# EAGLE design motoko_4_0 (EAGLE 9.0.0)
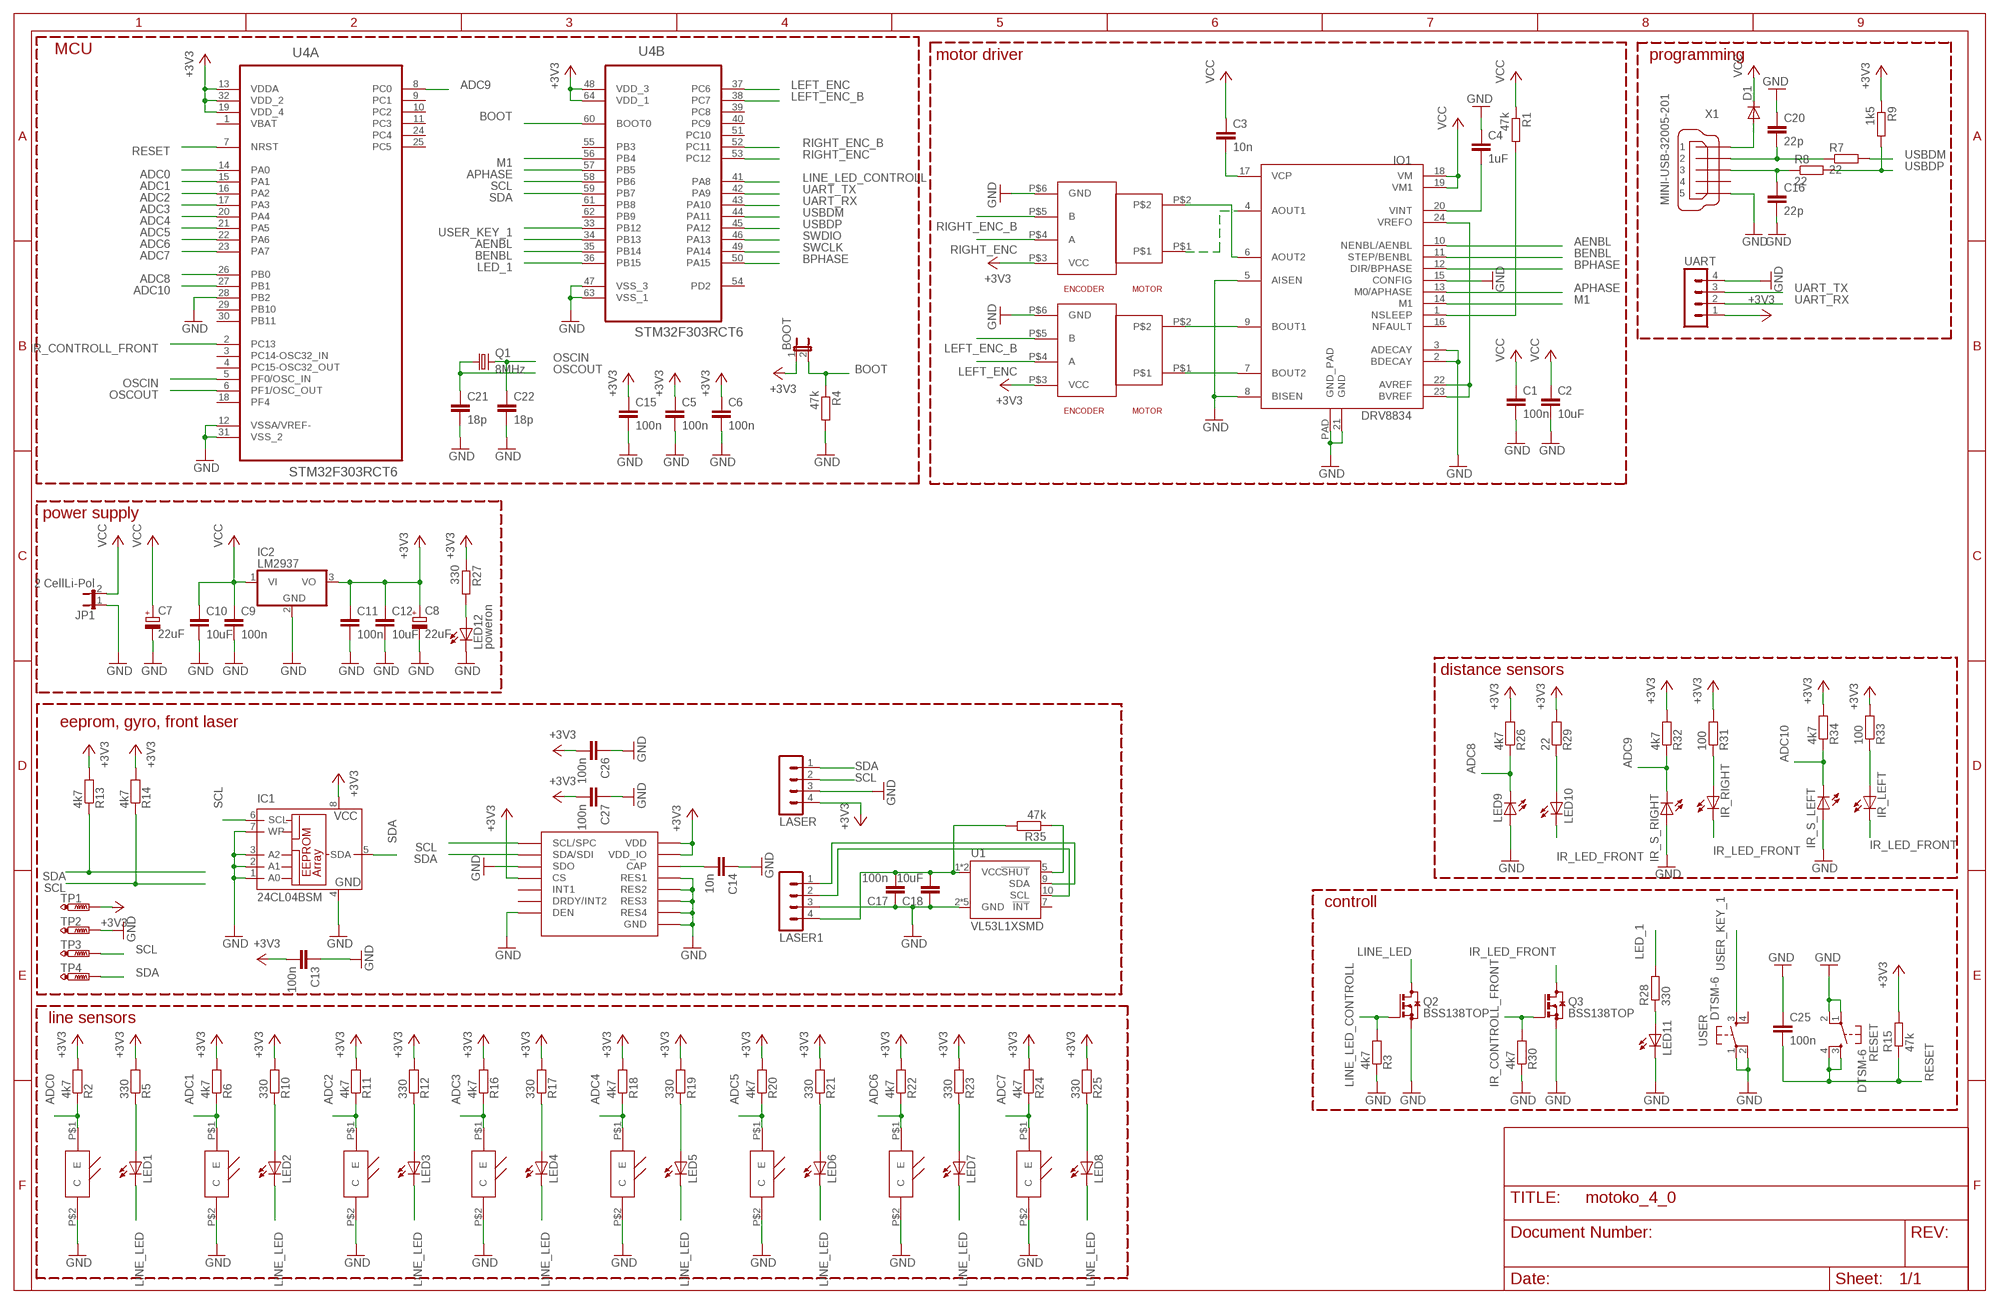
[diagram p0: schematic, sheet 1]

## Parts
BOOT  JP1E  [JP1]
C1  100n  C-EUC1206  [C1206]
C2  10uF  C-EUC1206  [C1206]
C3  10n  C-EUC1206  [C1206]
C4  1uF  C-EUC1206  [C1206]
C5  100n  C-EUC0805  [C0805]
C6  100n  C-EUC0805  [C0805]
C7  22uF  CPOL-EU153CLV-0505  [153CLV-0505]
C8  22uF  CPOL-EU153CLV-0505  [153CLV-0505]
C9  100n  C-EUC0805  [C0805]
C10  10uF  C-EUC0805  [C0805]
C11  100n  C-EUC0805  [C0805]
C12  10uF  C-EUC0805  [C0805]
C13  100n  C-EUC0805  [C0805]
C14  10n  C-EUC0805  [C0805]
C15  100n  C-EUC0805  [C0805]
C16  22p  C-EUC0805  [C0805]
C17  100n  C-EUC0805  [C0805]
C18  10uF  C-EUC0805  [C0805]
C20  22p  C-EUC0805  [C0805]
C21  18p  C-EUC0805  [C0805]
C22  18p  C-EUC0805  [C0805]
C25  100n  C-EUC0805  [C0805]
C26  100n  C-EUC0805  [C0805]
C27  100n  C-EUC0805  [C0805]
D1  DIODE-SMB  [SMB]
IC1  24CL04BSM  [SO-08M]
IC2  LM2937  [TO263-3]
IO1  DRV8834  [DRV8834_PCK]
IR_LEFT  LED5MM  [LED5MM]
IR_RIGHT  LED5MM  [LED5MM]
IR_S_LEFT  LED5MM  [LED5MM]
IR_S_RIGHT  LED5MM  [LED5MM]
JP1  2 CellLi-Pol  JP1E  [JP1]
LASER  MA04-1  [MA04-1]
LASER1  MA04-1  [MA04-1]
LED1  LEDCHIPLED_1206  [CHIPLED_1206]
LED2  LEDCHIPLED_1206  [CHIPLED_1206]
LED3  LEDCHIPLED_1206  [CHIPLED_1206]
LED4  LEDCHIPLED_1206  [CHIPLED_1206]
LED5  LEDCHIPLED_1206  [CHIPLED_1206]
LED6  LEDCHIPLED_1206  [CHIPLED_1206]
LED7  LEDCHIPLED_1206  [CHIPLED_1206]
LED8  LEDCHIPLED_1206  [CHIPLED_1206]
LED9  LED5MM  [LED5MM]
LED10  LED5MM  [LED5MM]
LED11  LEDCHIPLED_1206  [CHIPLED_1206]
LED12  poweron  LEDCHIPLED_1206  [CHIPLED_1206]
LSM6DS0  L3GD20H  [LGA16L]
Q1  8MHz  CRYSTALCTS406  [CTS406]
Q2  BSS138TOP  [SOT23]
Q3  BSS138TOP  [SOT23]
R1  47k  R-EU_M1206  [M1206]
R2  4k7  R-EU_M0805  [M0805]
R3  4k7  R-EU_M0805  [M0805]
R4  47k  R-EU_M0805  [M0805]
R5  330  R-EU_M0805  [M0805]
R6  4k7  R-EU_M0805  [M0805]
R7  22  R-EU_M0805  [M0805]
R8  22  R-EU_M0805  [M0805]
R9  1k5  R-EU_M0805  [M0805]
R10  330  R-EU_M0805  [M0805]
R11  4k7  R-EU_M0805  [M0805]
R12  330  R-EU_M0805  [M0805]
R13  4k7  R-EU_M0805  [M0805]
R14  4k7  R-EU_M0805  [M0805]
R15  47k  R-EU_M0805  [M0805]
R16  4k7  R-EU_M0805  [M0805]
R17  330  R-EU_M0805  [M0805]
R18  4k7  R-EU_M0805  [M0805]
R19  330  R-EU_M0805  [M0805]
R20  4k7  R-EU_M0805  [M0805]
R21  330  R-EU_M0805  [M0805]
R22  4k7  R-EU_M0805  [M0805]
R23  330  R-EU_M0805  [M0805]
R24  4k7  R-EU_M0805  [M0805]
R25  330  R-EU_M0805  [M0805]
R26  4k7  R-EU_M0805  [M0805]
R27  330  R-EU_M0805  [M0805]
R28  330  R-EU_M0805  [M0805]
R29  22  R-EU_M0805  [M0805]
R30  4k7  R-EU_M0805  [M0805]
R31  100  R-EU_M0805  [M0805]
R32  4k7  R-EU_M0805  [M0805]
R33  100  R-EU_M0805  [M0805]
R34  4k7  R-EU_M0805  [M0805]
R35  47k  R-EU_M0805  [M0805]
RESET  DTSM-6  [DTSM-6]
TP1  PTR1B1,27  [B1,27]
TP2  PTR1B1,27  [B1,27]
TP3  PTR1B1,27  [B1,27]
TP4  PTR1B1,27  [B1,27]
U1  VL53L1XSMD  [VL53L1X]
U4  STM32F303RCT6  [QFP50P1200X1200X160-64N]
U$3  SFH3710  [SFH3710]
U$4  SFH3710  [SFH3710]
U$5  SFH3710  [SFH3710]
U$6  SFH3710  [SFH3710]
U$7  SFH3710  [SFH3710]
U$8  SFH3710  [SFH3710]
U$9  SFH3710  [SFH3710]
U$10  SFH3710  [SFH3710]
U$11  POLOLU_GEAR_MOTORPOLO  [POLOLU_GEAR_MOTOR]
U$12  POLOLU_GEAR_MOTORPOLO  [POLOLU_GEAR_MOTOR]
UART  MA04-1  [MA04-1]
USER  DTSM-6  [DTSM-6]
X1  MINI-USB-32005-201  [32005-201]

## Nets
+3V3: BOOT.1 C5.1 C6.1 C8.+ C11.1 C12.1 C13.2 C15.1 C26.2 C27.2 IC1.8(VCC) IC2.3(VO) LASER.4 LSM6DS0.P$1(VDD_IO) LSM6DS0.P$5(CS) LSM6DS0.P$16(VDD) R2.2 R5.2 R6.2 R9.1 R10.2 R11.2 R12.2 R13.2 R14.2 R15.2 R16.2 R17.2 R18.2 R19.2 R20.2 R21.2 R22.2 R23.2 R24.2 R25.2 R26.2 R27.1 R29.2 R31.2 R32.2 R33.2 R34.2 TP1.TP U4.13(A:VDDA) U4.19(A:VDD_4) U4.32(A:VDD_2) U4.48(B:VDD_3) U4.64(B:VDD_1) U$11.P$3(VCC) U$12.P$3(VCC) UART.1
ADC0: R2.1 U4.14(A:PA0) U$3.P$1(E)
ADC1: R6.1 U4.15(A:PA1) U$4.P$1(E)
ADC2: R11.1 U4.16(A:PA2) U$5.P$1(E)
ADC3: R16.1 U4.17(A:PA3) U$6.P$1(E)
ADC4: R18.1 U4.20(A:PA4) U$7.P$1(E)
ADC5: R20.1 U4.21(A:PA5) U$8.P$1(E)
ADC6: R22.1 U4.22(A:PA6) U$9.P$1(E)
ADC7: R24.1 U4.23(A:PA7) U$10.P$1(E)
ADC8: LED9.K(C) R26.1 U4.26(A:PB0)
ADC9: IR_S_RIGHT.K(C) R32.1 U4.8(A:PC0)
ADC10: IR_S_LEFT.K(C) R34.1 U4.27(A:PB1)
AENBL: IO1.10(NENBL/AENBL) U4.34(B:PB13)
APHASE: IO1.13(M0/APHASE) U4.57(B:PB5)
BENBL: IO1.11(STEP/BENBL) U4.35(B:PB14)
BOOT: BOOT.2 R4.1 U4.60(B:BOOT0)
BPHASE: IO1.12(DIR/BPHASE) U4.50(B:PA15)
GND: C1.2 C2.2 C4.1 C5.2 C6.2 C7.- C8.- C9.2 C10.2 C11.2 C12.2 C13.1 C14.1 C15.2 C16.2 C17.1 C18.1 C20.1 C21.2 C22.2 C25.1 C26.1 C27.1 IC1.1(A0) IC1.2(A1) IC1.3(A2) IC1.4(GND) IC1.7(WP) IC2.2(GND) IO1.2(BDECAY) IO1.3(ADECAY) IO1.5(AISEN) IO1.8(BISEN) IO1.15(CONFIG) IO1.21(GND) IO1.PAD(GND_PAD) IR_S_LEFT.A IR_S_RIGHT.A JP1.1 LASER1.3 LASER.3 LED9.A LED11.C LED12.C LSM6DS0.P$4(SDO) LSM6DS0.P$8(DEN) LSM6DS0.P$9(RES1) LSM6DS0.P$10(RES2) LSM6DS0.P$11(RES3) LSM6DS0.P$12(GND) LSM6DS0.P$13(GND) LSM6DS0.P$15(RES4) Q2.2(S) Q3.2(S) R3.1 R4.2 R30.1 RESET.1 RESET.2 TP2.TP U1.2(GND) U1.3(GND) U1.4(GND) U1.6(GND) U1.12(GND) U4.12(A:VSSA/VREF-) U4.28(A:PB2) U4.31(A:VSS_2) U4.47(B:VSS_3) U4.63(B:VSS_1) U$3.P$2(C) U$4.P$2(C) U$5.P$2(C) U$6.P$2(C) U$7.P$2(C) U$8.P$2(C) U$9.P$2(C) U$10.P$2(C) U$11.P$6(GND) U$12.P$6(GND) UART.4 USER.1 USER.2 X1.5
IR_CONTROLL_FRONT: Q3.1(G) R30.2 U4.2(A:PC13)
IR_LED_FRONT: IR_LEFT.K(C) IR_RIGHT.K(C) LED10.K(C) Q3.3(D)
LED_1: R28.2 U4.36(B:PB15)
LEFT_ENC: U4.37(B:PC6) U$11.P$4(A)
LEFT_ENC_B: U4.38(B:PC7) U$11.P$5(B)
LINE_LED: LED1.C LED2.C LED3.C LED4.C LED5.C LED6.C LED7.C LED8.C Q2.3(D)
LINE_LED_CONTROLL: Q2.1(G) R3.2 U4.41(B:PA8)
M1: IO1.14(M1) U4.56(B:PB4)
N$1: IO1.6(AOUT2) U$12.P$2
N$2: IO1.4(AOUT1) U$12.P$1
N$3: IO1.7(BOUT2) U$11.P$1
N$4: IO1.9(BOUT1) U$11.P$2
N$5: C3.2 IO1.17(VCP)
N$6: C14.2 LSM6DS0.P$14(CAP)
N$7: LED10.A R29.1
N$8: IO1.22(AVREF) IO1.23(BVREF) IO1.24(VREFO)
N$9: IO1.1(NSLEEP) R1.2
N$13: IR_LEFT.A R33.1
N$14: LED1.A R5.1
N$15: LED2.A R10.1
N$16: LED3.A R12.1
N$17: LED4.A R17.1
N$18: LED5.A R19.1
N$19: LED6.A R21.1
N$20: LED7.A R23.1
N$21: LED8.A R25.1
N$22: C4.2 IO1.20(VINT)
N$23: LED12.A R27.2
N$24: IR_RIGHT.A R31.1
N$26: C17.2 C18.2 LASER1.4 R35.2 U1.1(VCC) U1.11(VCC)
N$27: LASER1.1 U1.9(SDA)
N$28: LASER1.2 U1.10(SCL)
N$29: R35.1 U1.5(!SHUT)
N$33: LED11.A R28.1
N$55: C20.2 R7.1 X1.2
N$56: C16.1 R8.1 X1.3
N$57: D1.A X1.1
OSCIN: C22.1 Q1.3 U4.5(A:PF0/OSC_IN)
OSCOUT: C21.1 Q1.1 U4.6(A:PF1/OSC_OUT)
RESET: C25.2 R15.1 RESET.3 RESET.4 U4.7(A:NRST)
RIGHT_ENC: U4.53(B:PC12) U$12.P$4(A)
RIGHT_ENC_B: U4.52(B:PC11) U$12.P$5(B)
SCL: IC1.6(SCL) LASER.2 LSM6DS0.P$2(SCL/SPC) R14.1 TP3.TP U4.58(B:PB6)
SDA: IC1.5(SDA) LASER.1 LSM6DS0.P$3(SDA/SDI) R13.1 TP4.TP U4.59(B:PB7)
SWCLK: U4.49(B:PA14)
SWDIO: U4.46(B:PA13)
UART_RX: U4.43(B:PA10) UART.2
UART_TX: U4.42(B:PA9) UART.3
USBDM: R7.2 U4.44(B:PA11)
USBDP: R8.2 R9.2 U4.45(B:PA12)
USER_KEY_1: U4.33(B:PB12) USER.3
VCC: C1.1 C2.1 C3.1 C7.+ C9.1 C10.1 D1.C IC2.1(VI) IO1.18(VM) IO1.19(VM1) JP1.2 R1.1
Unconnected: IO1.16(NFAULT) LSM6DS0.P$6(DRDY/INT2) LSM6DS0.P$7(INT1) U1.7(!INT) U4.3(A:PC14-OSC32_IN) U4.4(A:PC15-OSC32_OUT) U4.9(A:PC1) U4.10(A:PC2) U4.11(A:PC3) U4.18(A:PF4) U4.24(A:PC4) U4.25(A:PC5) U4.29(A:PB10) U4.30(A:PB11) U4.39(B:PC8) U4.40(B:PC9) U4.51(B:PC10) U4.54(B:PD2) U4.55(B:PB3) U4.61(B:PB8) U4.62(B:PB9) USER.4 X1.4

## Notes on the sheet
- MCU
- motor driver | programming
- power supply
- distance sensors
- eeprom, gyro, front laser
- controll
- line sensors

## Power pins joined to a net without a drawn wire
VBAT: U4.1(A:VBAT)

## Library data of the parts
BOOT JP1 = jumper:JP1E: JUMPER
C1-C6 C9-C18 C20-C22 C25-C27 = resistor:C-EU: CAPACITOR, European symbol
C7 C8 = resistor:CPOL-EU: POLARIZED CAPACITOR, European symbol
D1 = diode:DIODE-: DIODE
IC1 = microchip:24*: Serial EEPROM I2C; MPN: FM24CL04-S; OC_FARNELL: 1607928; OC_NEWARK: 97H6443
IC2 = linear:LM2937: LM2937-2.5, LM2937-3.3 400mA and 500mA Voltage Regulators Source: http://cache.national.com/ds/LM/LM2937-2.5.pdf
IO1 = yellow_car:DRV8834
IR_LEFT IR_RIGHT IR_S_LEFT IR_S_RIGHT LED9 LED10 = my_parts:LED: LED OSRAM: - CHIPLED LG R971, LG N971, LY N971, LG Q971, LY Q971, LO R971, LY R971 LH N974, LH R974 LS Q976, LO Q976, LY Q976 LO Q996 - Hyper CHIPLED LW Q18S LB Q993, LB Q99A, LB R99A - SideLED LS A670, LO A670, LY A670, LG A670, LP A670 LB A673, LV A673, LT A673, LW A673 LH A674 LY A675 LS A676, LA A676, LO A676, LY A676, LW A676 LS A679, LY A679, LG A679 - Hyper Micro SIDELED® LS Y876, LA Y876, LO Y876, LY Y876 LT Y87S - SmartLED LW L88C, LW L88S LB L89C, LB L89S, LG L890 LS L89K, LO L89K, LY L89K LS L896, LA L896, LO L896, LY L896 - TOPLED LS T670, LO T670, LY T670, LG T670, LP T670 LSG T670, LSP T670, LSY T670, LOP T670, LYG T670 LG T671, LOG T671, LSG T671 LB T673, LV T673, LT T673, LW T673 LH T674 LS T676, LA T676, LO T676, LY T676, LB T676, LH T676, LSB T676, LW T676 LB T67C, LV T67C, LT T67C, LS T67K, LO T67K, LY T67K, LW E67C LS E67B, LA E67B, LO E67B, LY E67B, LB E67C, LV E67C, LT E67C LW T67C LS T679, LY T679, LG T679 LS T770, LO T770, LY T770, LG T770, LP T770 LB T773, LV T773, LT T773, LW T773 LH T774 LS E675, LA E675, LY E675, LS T675 LS T776, LA T776, LO T776, LY T776, LB T776 LHGB T686 LT T68C, LB T68C - Hyper Mini TOPLED® LB M676 - Mini TOPLED Santana® LG M470 LS M47K, LO M47K, LY M47K Source: http://www.osram.convergy.de LUXEON: - LUMILED® LXK2-PW12-R00, LXK2-PW12-S00, LXK2-PW14-U00, LXK2-PW14-V00 LXK2-PM12-R00, LXK2-PM12-S00, LXK2-PM14-U00 LXK2-PE12-Q00, LXK2-PE12-R00, LXK2-PE12-S00, LXK2-PE14-T00, LXK2-PE14-U00 LXK2-PB12-K00, LXK2-PB12-L00, LXK2-PB12-M00, LXK2-PB14-N00, LXK2-PB14-P00, LXK2-PB14-Q00 LXK2-PR12-L00, LXK2-PR12-M00, LXK2-PR14-Q00, LXK2-PR14-R00 LXK2-PD12-Q00, LXK2-PD12-R00, LXK2-PD12-S00 LXK2-PH12-R00, LXK2-PH12-S00 LXK2-PL12-P00, LXK2-PL12-Q00, LXK2-PL12-R00 Source: www.luxeon.com KINGBRIGHT: KA-3528ASYC Source: www.kingbright.com
LASER LASER1 UART = con-lstb:MA04-1: PIN HEADER; OC_FARNELL: unknown; OC_NEWARK: unknown
LED1-LED8 LED11 LED12 = led:LED: LED OSRAM: - CHIPLED LG R971, LG N971, LY N971, LG Q971, LY Q971, LO R971, LY R971 LH N974, LH R974 LS Q976, LO Q976, LY Q976 LO Q996 - Hyper CHIPLED LW Q18S LB Q993, LB Q99A, LB R99A - SideLED LS A670, LO A670, LY A670, LG A670, LP A670 LB A673, LV A673, LT A673, LW A673 LH A674 LY A675 LS A676, LA A676, LO A676, LY A676, LW A676 LS A679, LY A679, LG A679 - Hyper Micro SIDELED® LS Y876, LA Y876, LO Y876, LY Y876 LT Y87S - SmartLED LW L88C, LW L88S LB L89C, LB L89S, LG L890 LS L89K, LO L89K, LY L89K LS L896, LA L896, LO L896, LY L896 - TOPLED LS T670, LO T670, LY T670, LG T670, LP T670 LSG T670, LSP T670, LSY T670, LOP T670, LYG T670 LG T671, LOG T671, LSG T671 LB T673, LV T673, LT T673, LW T673 LH T674 LS T676, LA T676, LO T676, LY T676, LB T676, LH T676, LSB T676, LW T676 LB T67C, LV T67C, LT T67C, LS T67K, LO T67K, LY T67K, LW E67C LS E67B, LA E67B, LO E67B, LY E67B, LB E67C, LV E67C, LT E67C LW T67C LS T679, LY T679, LG T679 LS T770, LO T770, LY T770, LG T770, LP T770 LB T773, LV T773, LT T773, LW T773 LH T774 LS E675, LA E675, LY E675, LS T675 LS T776, LA T776, LO T776, LY T776, LB T776 LHGB T686 LT T68C, LB T68C - Hyper Mini TOPLED® LB M676 - Mini TOPLED Santana® LG M470 LS M47K, LO M47K, LY M47K Source: http://www.osram.convergy.de LUXEON: - LUMILED® LXK2-PW12-R00, LXK2-PW12-S00, LXK2-PW14-U00, LXK2-PW14-V00 LXK2-PM12-R00, LXK2-PM12-S00, LXK2-PM14-U00 LXK2-PE12-Q00, LXK2-PE12-R00, LXK2-PE12-S00, LXK2-PE14-T00, LXK2-PE14-U00 LXK2-PB12-K00, LXK2-PB12-L00, LXK2-PB12-M00, LXK2-PB14-N00, LXK2-PB14-P00, LXK2-PB14-Q00 LXK2-PR12-L00, LXK2-PR12-M00, LXK2-PR14-Q00, LXK2-PR14-R00 LXK2-PD12-Q00, LXK2-PD12-R00, LXK2-PD12-S00 LXK2-PH12-R00, LXK2-PH12-S00 LXK2-PL12-P00, LXK2-PL12-Q00, LXK2-PL12-R00 Source: www.luxeon.com KINGBRIGHT: KA-3528ASYC Source: www.kingbright.com
LSM6DS0 = st:L3GD20H
Q1 = crystal:CRYSTAL: CRYSTAL; OC_FARNELL: unknown; OC_NEWARK: unknown
Q2 Q3 = JCM:BSS138
R1-R35 = resistor:R-EU_: RESISTOR, European symbol
RESET USER = switch-tact:DTSM-6
TP1-TP4 = testpad:PTR1: TEST PIN
U1 = SparkFun-Sensors:VL53L1X: STMicroelectronics VL53L1X - 400 cm IR Laser ToF Sensor VL53L1X is a state-of-the-art ToF laser-ranging sensor, enhancing the ST FlightSense product family. It is the fastest miniature ToF sensor currently on the market with accurate ranging up to 4 m and fast ranging frequency (up to 50 Hz). Housed in a miniature and reflowable package, it integrates a single photon avalanche diode (SPAD) receiving array, a 940 nm invisible laser Class 1 emitter, physical infrared filters, and optics to achieve the best ranging performance in various ambient lighting conditions with a range of cover window options.; PROD_ID: IC-13960
U4 = my_parts:STM32F303RCT6: ARM Cortex-M4 32b MCU+FPU,LQFP-64; MPN: STM32F303RCT6; OC_FARNELL: 2215112; OC_NEWARK: 46W2193; PACKAGE: LQFP-64; SUPPLIER: STMICROELECTRONICS
U$3-U$10 = my_parts:SFH3710
U$11 U$12 = my_parts:POLOLU_GEAR_MOTOR
X1 = con-cypressindustries:MINI-USB-: MINI USB-B Conector Source: www.cypressindustries.com; OC_FARNELL: unknown; OC_NEWARK: unknown

## Board
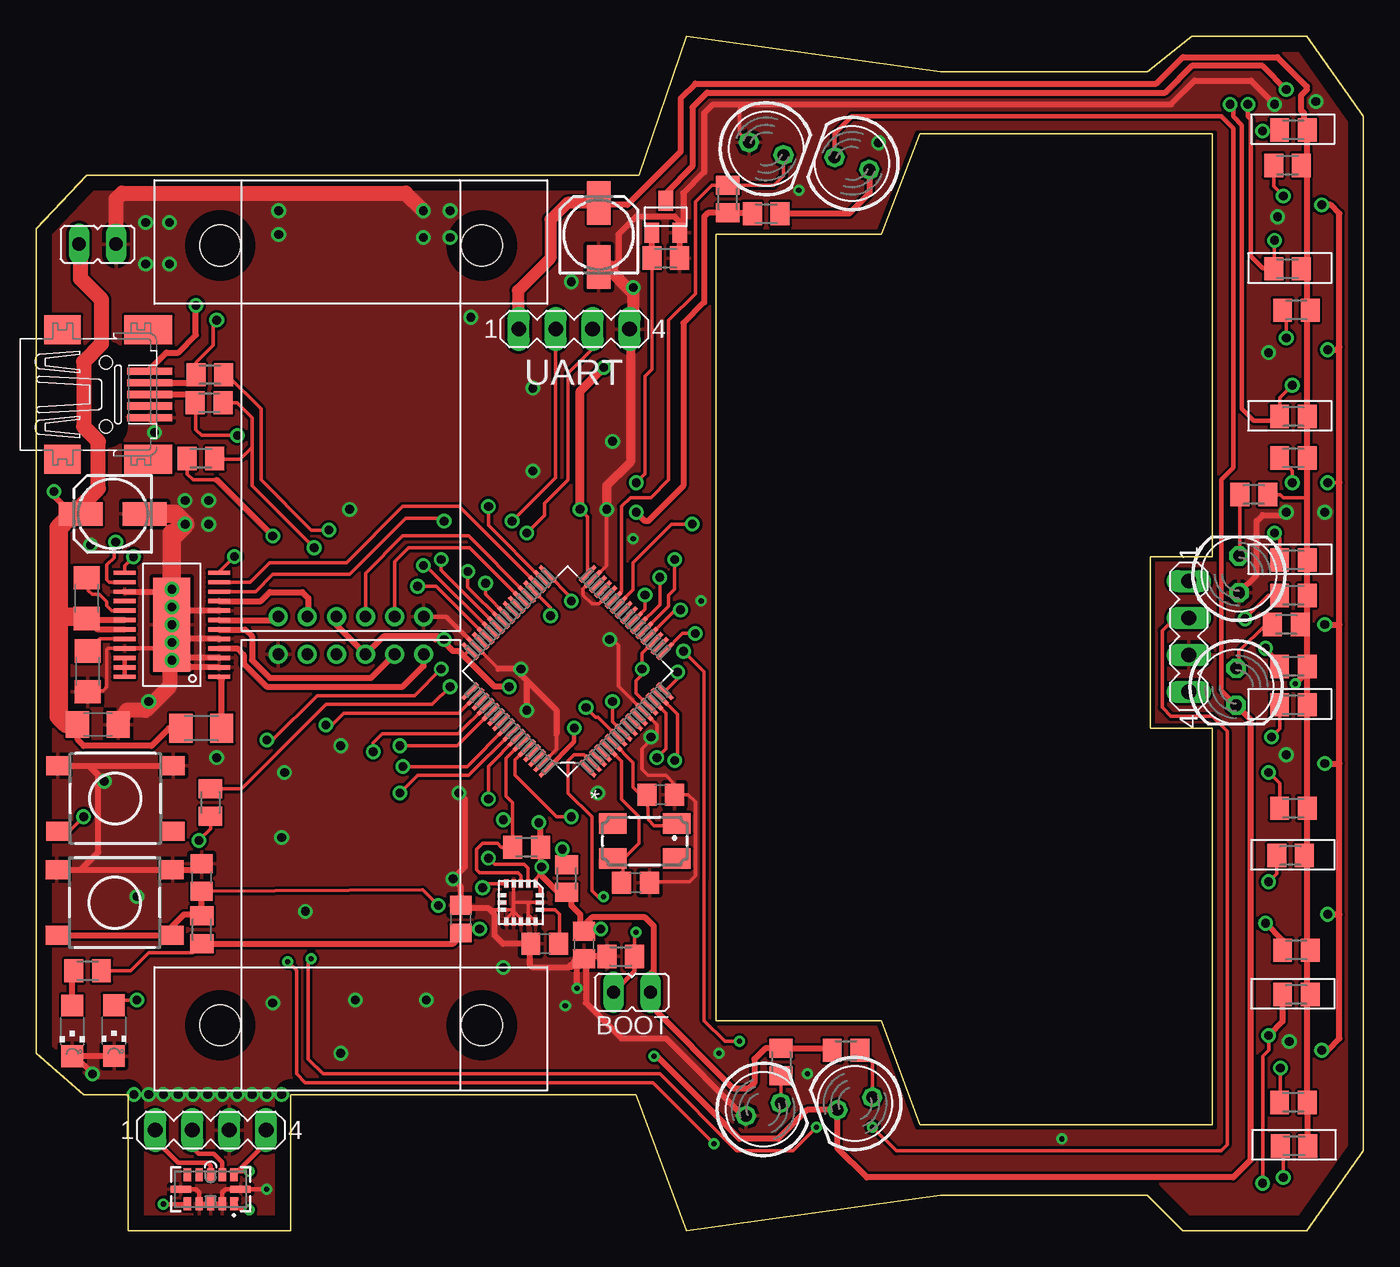
[diagram p1: board, top side]
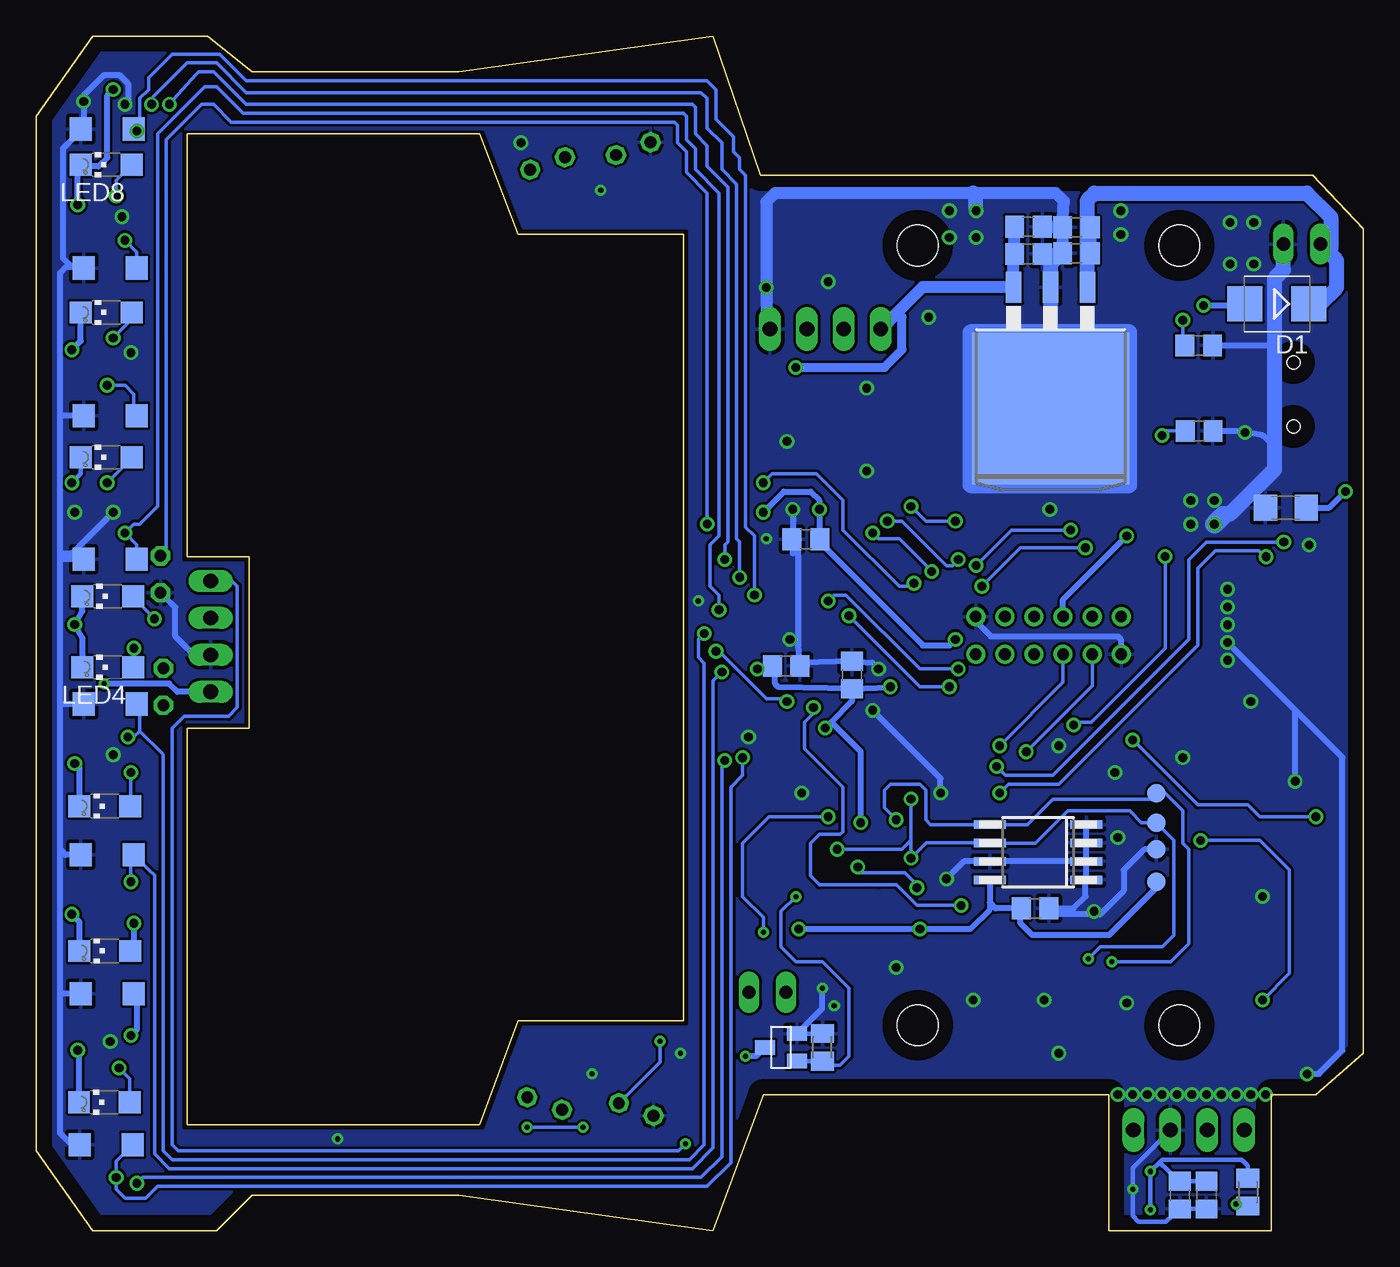
[diagram p2: board, bottom side, seen from below]

Size 91.24 x 82.09 mm. Coordinates in mm from the lower left corner, seen from the top.
Outline: 0,68.89 0,12.19 3.25,9.35 6.3,9.35 6.3,0 17.48,0 17.48,9.35 41.25,9.35 44.7,0 62.18,2.44 76.4,2.44 78.84,0 87.38,0 91.24,5.49 91.24,76.61 87.38,82.09 79.45,82.09 76.4,79.65 62.18,79.65 44.7,82.09 41.45,72.54 3.45,72.54 0,68.89
Copper layers (1*16): Top 0.035mm / dielectric 1.5mm / Bottom 0.035mm
Design rules "default *": minimum track width 8mil, minimum drill 24mil, track to track 7mil, track to pad 7mil, pad to pad 7mil, via to via 7mil, smd to smd 7mil, copper to edge 40mil, drill to drill 8mil, minimum pad ring 10mil, minimum via ring 8mil, stop-mask expansion 4mil, vias tented up to drill 30mil, thermal gap 10mil
tRestrict: area 46.5,7.1 to 81.1,75.5
bRestrict: area 46.5,7.1 to 81.1,75.5
Milling: area 46.7,7.3 to 80.9,75.4

### Footprints (pad centres in the part's own frame; a part is rotated, then mirrored left to right if it is on the bottom)
JP1 = drill 0.914 long: 1 0,-1.27; 2 0,1.27
C1206 = smd 1.6 x 1.8: 1 -1.4,0; 2 1.4,0
C0805 = smd 1.3 x 1.5: 1 -0.95,0; 2 0.95,0
153CLV-0505 = smd 3 x 1.6: + 2.2,0; - -2.2,0
SMB = smd 2.4 x 2.4: A 2.2,0; C -2.2,0
SO-08M = smd 0.6 x 2.2: 1 -1.905,-3.33; 2 -0.635,-3.33; 3 0.635,-3.33; 4 1.905,-3.33; 5 1.905,3.33; 6 0.635,3.33; 7 -0.635,3.33; 8 -1.905,3.33
TO263-3 = smd 1.067 x 2.159: 1 -2.54,-5.791; 2 0,-5.791; 3 2.54,-5.791 | smd 10.8 x 10.41: TAB 0,2.54
DRV8834_PCK = smd 0.3 x 1.5: 1 -3.575,-3.25; 2 -2.925,-3.25; 3 -2.275,-3.25; 4 -1.625,-3.25; 5 -0.975,-3.25; 6 -0.325,-3.25; 7 0.325,-3.25; 8 0.975,-3.25; 9 1.625,-3.25; 10 2.275,-3.25; 11 2.925,-3.25; 12 3.575,-3.25; 13 3.575,3.25; 14 2.925,3.25; 15 2.275,3.25; 16 1.625,3.25; 17 0.975,3.25; 18 0.325,3.25; 19 -0.325,3.25; 20 -0.975,3.25; 21 -1.625,3.25; 22 -2.275,3.25; 23 -2.925,3.25; 24 -3.575,3.25 | smd 6.452 x 2.54: PAD 0,0
LED5MM = drill 0.813 octagon: A -1.27,0; K 1.27,0
MA04-1 = drill 1.016 long: 1 -3.81,0; 2 -1.27,0; 3 1.27,0; 4 3.81,0
CHIPLED_1206 = smd 1.5 x 1.5: A 0,-1.75; C 0,1.75
LGA16L = smd 0.6 x 0.3: P$1 -1.3,1; P$2 -1.3,0.5; P$3 -1.3,0; P$4 -1.3,-0.5; P$5 -1.3,-1; P$9 1.3,-1; P$10 1.3,-0.5; P$11 1.3,0; P$12 1.3,0.5; P$13 1.3,1 | smd 0.3 x 0.6: P$6 -0.5,-1.3; P$7 0,-1.3; P$8 0.5,-1.3; P$14 0.5,1.3; P$15 0,1.3; P$16 -0.5,1.3
CTS406 = smd 1.9 x 1.4: 1 -2.2,-1.2; 2 2.2,-1.2; 3 2.2,1.2; 4 -2.2,1.2
SOT23 = smd 1 x 1.4: 1 -0.95,-1.1; 2 0.95,-1.1; 3 0,1.1
M1206 = smd 1.6 x 2: 1 -1.4,0; 2 1.4,0
M0805 = smd 1.3 x 1.6: 1 -0.95,0; 2 0.95,0
DTSM-6 = smd 1.55 x 1.3: 1 -3.975,2.25; 2 3.975,2.25; 3 -3.975,-2.25; 4 3.975,-2.25
B1,27 = smd 1.27 x 1.27: TP 0,0
VL53L1X = smd 0.5 x 0.9: 1 1.6,-1; 2 0.8,-1; 3 0,-1; 4 -0.8,-1; 5 -1.6,-1; 7 -1.6,1; 8 -0.8,1; 9 0,1; 10 0.8,1; 11 1.6,1 | smd 1.4 x 0.5: 6 -2.05,0; 12 2.05,0
QFP50P1200X1200X160-64N = smd 1.473 x 0.279: 1 -5.715,3.759; 2 -5.715,3.251; 3 -5.715,2.743; 4 -5.715,2.261; 5 -5.715,1.753; 6 -5.715,1.245; 7 -5.715,0.762; 8 -5.715,0.254; 9 -5.715,-0.254; 10 -5.715,-0.762; 11 -5.715,-1.245; 12 -5.715,-1.753; 13 -5.715,-2.261; 14 -5.715,-2.743; 15 -5.715,-3.251; 16 -5.715,-3.759; 33 5.715,-3.759; 34 5.715,-3.251; 35 5.715,-2.743; 36 5.715,-2.261; 37 5.715,-1.753; 38 5.715,-1.245; 39 5.715,-0.762; 40 5.715,-0.254; 41 5.715,0.254; 42 5.715,0.762; 43 5.715,1.245; 44 5.715,1.753; 45 5.715,2.261; 46 5.715,2.743; 47 5.715,3.251; 48 5.715,3.759 | smd 0.279 x 1.473: 17 -3.759,-5.715; 18 -3.251,-5.715; 19 -2.743,-5.715; 20 -2.261,-5.715; 21 -1.753,-5.715; 22 -1.245,-5.715; 23 -0.762,-5.715; 24 -0.254,-5.715; 25 0.254,-5.715; 26 0.762,-5.715; 27 1.245,-5.715; 28 1.753,-5.715; 29 2.261,-5.715; 30 2.743,-5.715; 31 3.251,-5.715; 32 3.759,-5.715; 49 3.759,5.715; 50 3.251,5.715; 51 2.743,5.715; 52 2.261,5.715; 53 1.753,5.715; 54 1.245,5.715; 55 0.762,5.715; 56 0.254,5.715; 57 -0.254,5.715; 58 -0.762,5.715; 59 -1.245,5.715; 60 -1.753,5.715; 61 -2.261,5.715; 62 -2.743,5.715; 63 -3.251,5.715; 64 -3.759,5.715
SFH3710 = smd 1.52 x 1.6: P$1 -1.75,0; P$2 1.9,0
POLOLU_GEAR_MOTOR = drill 0.8: P$1 -5,-14.5; P$2 -3,-14.5; P$3 -1,-14.5; P$4 1,-14.5; P$5 3,-14.5; P$6 5,-14.5 | hole 2.8: -9,11; 9,11
32005-201 = smd 3.1 x 0.5: 1 3,1.6; 2 3,0.8; 3 3,0; 4 3,-0.8; 5 3,-1.6 | smd 2.5 x 2: M1 -3,-4.45; M2 -3,4.45 | smd 3.3 x 2: M3 2.9,4.45; M4 2.9,-4.45 | hole 0.9: 0,2.2; 0,-2.2

### Placement (x,y rotation side)
BOOT  40.96,16.39 90 top
C1  5.32,49.69 180 bottom
C2  4.23,34.79 0 top
C3  3.47,43.47 90 top
C4  3.52,38.44 90 top
C5  38.32,47.53 180 bottom
C6  35.15,38.2 90 bottom
C7  5.25,49.26 180 top
C8  38.67,68.45 90 top
C9  19.72,67.19 180 bottom
C10  19.72,68.96 180 bottom
C11  23.02,69.02 0 bottom
C12  23.02,67.14 0 bottom
C13  22.56,22.15 180 bottom
C14  34.95,19.71 0 top
C15  39.68,38.82 0 bottom
C16  11.27,54.97 0 bottom
C17  12.6,2.44 90 bottom
C18  10.77,2.44 90 bottom
C20  11.3,60.85 180 bottom
C21  42.93,29.97 0 top
C22  41.2,23.92 0 top
C25  11.37,24.28 270 top
C26  37.66,19.64 90 top
C27  29.2,21.41 270 top
D1  5.93,63.7 180 bottom
IC1  22.35,26.01 90 bottom
IC2  21.49,59.06 180 bottom
IO1  9.31,41.64 90 top
IR_LEFT  56.29,8.74 200 top
IR_RIGHT  56.08,73.36 160 top
IR_S_LEFT  50.19,74.37 340 top
IR_S_RIGHT  49.99,8.33 20 top
JP1  4.21,67.81 90 top
LASER  79.25,40.84 270 top
LASER1  11.99,6.91 0 top
LED1  86.56,8.82 90 bottom
LED2  86.53,19.22 90 bottom
LED3  86.53,29.18 90 bottom
LED4  86.33,38.73 90 bottom
LED5  86.33,43.61 90 bottom
LED6  86.43,53.16 90 bottom
LED7  86.43,63.12 90 bottom
LED8  86.43,73.28 90 bottom
LED9  82.7,45.11 90 top
LED10  82.5,37.39 270 top
LED11  5.34,13.75 180 top
LED12  2.47,13.73 180 top
LSM6DS0  33.32,22.56 270 top
Q1  41.83,26.78 180 top
Q2  43.28,69.7 0 top
Q3  40.03,12.6 90 bottom
R1  11.35,34.53 0 top
R2  86.48,5.82 0 top
R3  43.28,66.85 180 top
R4  40.19,18.85 180 top
R5  86.44,8.81 0 top
R6  86.64,16.23 0 top
R7  11.93,58.83 0 top
R8  11.88,56.9 0 top
R9  11.32,53.08 0 top
R10  86.64,19.28 0 top
R11  86.24,25.78 0 top
R12  86.44,29.03 0 top
R13  33.71,26.35 0 top
R14  36.46,24.2 270 top
R15  11.38,20.68 270 top
R16  86.44,36.14 0 top
R17  86.44,38.78 0 top
R18  86.44,46.1 0 top
R19  86.44,43.66 0 top
R20  86.44,55.95 0 top
R21  86.44,53.11 0 top
R22  86.03,66.11 0 top
R23  86.64,63.27 0 top
R24  86.44,75.66 0 top
R25  86.03,73.23 0 top
R26  83.72,50.6 0 top
R27  3.53,17.87 180 top
R28  11.97,29.43 90 top
R29  85.95,41.66 0 top
R30  37.19,12.6 270 bottom
R31  50.19,69.9 180 top
R32  51.21,11.58 90 top
R33  55.68,12.4 180 top
R34  47.55,70.92 270 top
R35  7.92,2.64 90 bottom
RESET  5.39,22.55 0 top
TP1  14.22,23.98 0 bottom
TP2  14.22,26.21 0 bottom
TP3  14.22,28.04 0 bottom
TP4  14.22,30.07 0 bottom
U1  11.99,2.84 0 top
U4  36.53,38.45 135 top
U$3  86.36,5.9 180 bottom
U$4  86.28,16.28 180 bottom
U$5  86.28,25.84 180 bottom
U$6  86.08,36.2 180 bottom
U$7  86.08,46.16 180 bottom
U$8  86.08,56.01 180 bottom
U$9  86.08,66.17 180 bottom
U$10  86.28,75.72 180 bottom
U$11  21.64,56.71 0 top
U$12  21.64,25.12 180 top
UART  36.98,61.98 0 top
USER  5.43,29.7 0 top
X1  4.8,57.48 0 top

### Tracks (layer width: path | path; a pad name or v marks a point on that pad's centre or on a via)
+3V3  (via drill 0.35, 0.6)
  Top 0.254: R27.1 6.49,17.87 7.72,19.1 10.76,19.1 R15.2 | R9.1 10.37,52.01 10.77,51.61 12.4,51.61 | U4.32 37.91,49.06 v37.39,49.58 | U4.19 41.66,39.7 v41.66,38.61 41.66,38.2 41.25,37.8 41.25,36.93 U4.13 | R25.2 87.11,73.23 87.39,72.95 | R24.2 87.39,75.4 87.38,75.39 | 36.78,23.17 R14.2 | 37.16,21.97 37.39,21.74 | 36.78,23.17 | R26.2 85.55,50.6 85.75,50.39 87.39,50.39 | R29.2 86.9,41.78 87.19,42.06 | 34.75,24.59 34.65,24.49 34.33,24.17 LSM6DS0.P$1 34.63,23.56 LSM6DS0.P$16 | U4.48 29.67,39.83 29.37,39.53 | LSM6DS0.P$5 30.97,23.86 v30.68,23.57 | v34.75,24.99 34.66,24.99
  Top 0.305: v36.98,34.54 36.98,33.59 U4.64 | v38.81,20.73 37.69,20.73 C26.2 | 42.47,16.87 42.47,16.63 BOOT.1 42.23,15.48
  Top 0.406: U$11.P$3 20.64,41.62 U$12.P$3 23.86,40.84 27.23,40.84 | C8.+ 38.81,70.51 40.64,70.51 44.3,74.17 44.3,77.83 45.31,78.84 77.01,78.84 78.84,80.67 85.34,80.67 87.38,78.64 87.38,78.44 86.97,78.03 86.97,77.01 87.17,76.81 87.17,75.88 R24.2 87.39,72.95 87.39,66.24 | 27.23,40.84 27.64,40.84 28.64,39.83 29.06,39.83 29.37,39.53 31.5,37.39 v32.51,37.39 | v16.26,47.75 12.4,51.61 | v28.04,40.64 27.43,40.64 27.23,40.84 | 33.33,64.01 33.12,63.81 | R2.2 87.43,8.77 R5.2 87.39,16.26 | 87.39,16.26 87.39,18.9 | 87.39,18.9 87.39,25.81 | 87.39,25.81 R12.2 R16.2 R17.2 | R17.2 87.39,41.86 | 87.39,41.86 R19.2 R18.2 87.39,50.39 R21.2 R20.2 87.39,63.81 | R11.2 87.36,25.78 87.39,25.81 | R10.2 87.59,19.1 87.39,18.9 | R6.2 87.42,16.23 87.39,16.26 | 87.39,63.81 87.39,66.24 | R22.2 87.26,66.11 87.39,66.24 | R23.2 87.59,63.6 87.39,63.81 | 87.19,42.06 87.39,41.86 | 87.38,75.39 87.38,76 | v34.54,28.04 34.66,27.93 R13.2 34.66,24.99 34.66,24.67 34.75,24.59 | 36.78,23.17 36.78,22.35 37.39,21.74 37.39,20.73 | R14.2 36.75,23.37 35.76,23.37 34.65,24.49 | 37.39,20.73 37.39,20.55 C26.2 | 30.68,20.73 v30.48,20.73 29.67,20.73 | R15.2 28.67,19.73 29.67,20.73 | 29.67,20.73 29.36,20.73 C27.2 | R31.2 49.51,69.97 R34.2 46.19,69.97 45.92,69.7 45.92,63.81 44.5,62.38 44.5,51.21 42.06,48.77 41.86,48.77 v41.25,49.38 | R33.2 54.59,12.53 R32.2 50.12,12.53 49.38,11.79 49.38,10.16 48.97,9.75 47.96,9.75 42.23,15.48 | v86.56,37.59 87.39,38.42 R17.2 | 37.39,20.73 38.2,21.54 41.86,21.54 42.47,20.93 42.47,17.88 | 42.47,16.87 42.47,17.88 | 42.23,17.64 42.47,17.88
  Top 0.61: v37.39,49.58 37.39,57.71 v39.01,59.33
  Top 0.813: C8.+ 36.51,70.65 35.36,69.49 35.36,66.85 33.12,64.62 33.12,63.81 33.12,62.03 UART.1
  Bottom 0.254: v37.39,49.58 37.39,47.61 C5.1 | C15.1 41.45,38.82 v41.66,38.61 | v30.68,23.57 30.68,23.77 31.5,24.59 34.75,24.59 v34.75,24.99
  Bottom 0.406: U$11.P$3 20.64,43.37 v16.26,47.75 | v28.04,40.64 28.45,40.23 30.28,40.23 37.39,47.35 v37.39,49.58 37.39,50.19 38,50.8 39.83,50.8 v41.25,49.38 | C6.1 40.2,37.35 40.44,37.59 40.44,38.72 C15.1 | C6.1 32.55,37.35 v32.51,37.39 | C6.1 35.15,36.37 36.58,34.95 | 36.58,34.95 v36.98,34.54 | v34.54,28.04 34.54,32.92 36.58,34.95 | IC1.8 25.68,22.56 | 25.68,22.56 25.68,22.07 27.03,20.73 v30.48,20.73 v38.81,20.73 | 25.68,22.56 25.28,22.15 C13.2 23.57,21.98 23.57,21.13 22.76,20.32 17.48,20.32 14.22,23.57 TP1.TP | LASER.4 81.53,37.03 82.09,37.59 v86.56,37.59
  Bottom 0.61: v39.01,59.33 32.92,59.33 31.7,60.55 31.7,62.79 32.03,63.12
  Bottom 0.813: C11.1 C12.1 24.03,66.97 IC2.3 30.3,64.85 32.03,63.12 UART.1
ADC0  (via drill 0.6)
  Top 0.254: U4.14 43.28,35.58 43.28,33.12 v42.67,32.51 | v85.75,3.66 85.75,5.6 R2.1
  Bottom 0.254: v42.67,32.51 42.67,31.29 43.49,30.48 43.49,4.67 45.11,3.05 82.91,3.05 83.72,2.24 85.14,2.24 85.75,2.85 v85.75,3.66 | v85.75,3.66 85.75,4.76 U$3.P$1 | v85.75,3.66 85.75,3.25
ADC1  (via drill 0.6)
  Top 0.254: U4.15 44.09,35.48 44.09,32.51 v43.89,32.31 | R6.1 85.69,15.79 | v84.73,13.41 84.73,12.4 84.33,11.99 v84.33,3.25
  Top 0.406: 85.69,15.79 85.69,14.37 v84.73,13.41
  Bottom 0.254: v43.89,32.31 44.09,32.11 44.09,5.08 45.52,3.66 83.92,3.66 v84.33,3.25 | 84.33,16.08 U$4.P$1
  Bottom 0.406: 84.33,16.08 84.33,13.82 v84.73,13.41
ADC2  (via drill 0.6)
  Top 0.254: U4.16 44.09,37.94 v44.09,38.41 | R11.1 85.29,24.53 v84.73,23.98
  Bottom 0.254: v44.09,38.41 44.7,37.8 44.7,5.69 46.13,4.27 75.59,4.27 75.79,4.27 82.09,4.27 83.11,5.28 83.11,24.41 83.5,24.81 U$5.P$1 84.73,25.63 v84.73,23.98
ADC3  (via drill 0.6)
  Top 0.254: U4.17 44.44,41.05 v45.31,41.05 | R16.1 85.49,34.49 v84.94,33.93
  Bottom 0.254: 84.13,34.34 82.6,32.82 82.5,32.72 82.5,5.49 81.89,4.88 46.33,4.88 45.31,5.89 45.31,39.01 45.72,39.42 45.72,40.64 v45.31,41.05 | 84.13,34.34 84.13,36 U$6.P$1 | v84.94,33.93 84.53,33.93 84.13,34.34
ADC4  (via drill 0.6)
  Top 0.254: U4.20 43.95,42.67 v44.3,42.67 | R18.1 85.49,47.61 v85.14,47.96
  Bottom 0.254: v44.3,42.67 44.3,43.69 44.91,44.3 44.91,47.14 44.3,47.75 44.3,71.32 45.92,72.95 45.92,74.37 46.53,74.98 46.53,76.61 46.74,76.81 77.01,76.81 78.84,78.64 79.65,78.64 82.91,75.39 82.91,49.78 84.13,48.57 84.53,48.57 v85.14,47.96 84.33,47.14 U$7.P$1
ADC5  (via drill 0.6)
  Top 0.254: U4.21 43.49,42.93 43.49,43.69 43.89,44.09 v43.89,46.13 | R20.1 85.49,57.25 v86.36,58.12 | 82.3,77.22 v82.09,77.42
  Top 0.305: 82.3,77.22 82.3,76.61 82.91,76 82.91,56.49 83.72,55.68 85.21,55.68 R20.1
  Bottom 0.254: v43.89,46.13 43.89,47.14 43.69,47.35 43.69,71.73 45.11,73.15 45.11,74.57 45.92,75.39 45.92,77.22 46.13,77.42 76.81,77.42 79.05,79.65 80.06,79.65 80.26,79.45 v82.09,77.42 | v86.36,58.12 85.14,58.12 84.53,57.51 84.53,56.21 U$8.P$1
ADC6  (via drill 0.6)
  Top 0.254: U4.22 42.88,43.04 v42.88,44.91 | v85.14,68.07 85.14,66.17 R22.1 85.01,66.04
  Top 0.305: v83.31,77.42 83.31,76.61 83.52,76.4 83.52,66.98 U$9.P$1 85.03,66.17 R22.1
  Bottom 0.254: v42.88,44.91 42.88,47.35 43.08,47.55 43.08,71.93 44.09,72.95 44.09,74.78 45.11,75.79 45.11,77.83 45.52,78.23 76.81,78.23 78.84,80.26 80.87,80.26 83.31,77.83 v83.31,77.42 | U$9.P$1 84.33,67.26 v85.14,68.07
ADC7  (via drill 0.6)
  Top 0.254: U4.23 41.86,42.71 v41.86,43.69 | 85.49,76.05 R24.1 85.42,75.59 v84.33,75.59
  Bottom 0.254: v41.86,43.69 41.86,47.75 42.47,48.36 42.47,72.54 42.88,72.95 42.88,73.76 43.28,74.17 43.28,75.18 44.5,76.4 44.5,78.44 45.11,79.05 76.81,79.05 77.62,79.86 78.64,80.87 81.89,80.87 83.52,79.25 83.52,78.44 84.13,77.83 84.13,76.13 U$10.P$1 | v84.33,75.59 84.33,75.92 U$10.P$1 | 84.73,75.92 U$10.P$1
ADC8  (via drill 0.6)
  Top 0.254: U4.26 41.05,44.05 41.05,45.92 43.69,48.57 v45.11,48.57 | R26.1 82.77,46.45 LED9.K
  Bottom 0.254: 82.3,46.58 LED9.K 82.3,46.79 82.3,74.98 79.86,77.42 79.05,77.42 77.83,76.2 47.35,76.2 47.14,76 47.14,74.78 46.53,74.17 46.53,72.75 45.11,71.32 v45.11,48.57
ADC9  (via drill 0.35, 0.6)
  Top 0.254: U4.8 39.62,35 v39.62,36.37 | v44.5,39.83 45.92,38.41 45.92,24.38 45.92,24.18 45.92,14.43 47.35,13.01 v48.36,13.01 | R32.1 51.21,8.79 IR_S_RIGHT.K
  Bottom 0.254: v39.62,36.37 39.83,36.58 41.05,36.58 44.3,39.83 v44.5,39.83 | v48.36,13.01 48.36,11.58 IR_S_RIGHT.K
ADC10
  Top 0.254: U4.27 40.23,43.92 40.23,49.78 40.84,50.39 42.27,50.39 43.49,51.61 43.49,62.59 45.31,64.41 45.31,70.71 46.47,71.87 R34.1 50.73,71.87 51.38,72.52 IR_S_LEFT.K
AENBL  (via drill 0.6)
  Top 0.254: IO1.10 15.07,43.92 16.26,45.11 21.54,45.11 25.4,48.97 27.84,48.97 v28.04,48.77 | v31.09,49.78 31.09,48.49 U4.34
  Bottom 0.254: v28.04,48.77 30.07,48.77 v31.09,49.78
APHASE  (via drill 0.6)
  Top 0.254: IO1.13 6.06,45.71 v6.67,46.32 | v24.99,30.07 26.21,31.29 29.73,31.29 U4.57
  Bottom 0.254: v6.67,46.32 6.77,46.32 7.18,46.73 10.17,46.73 11.38,45.52 11.38,40.23 20.93,30.68 24.38,30.68 v24.99,30.07
BENBL
  Top 0.254: IO1.11 14.7,44.57 16.05,45.92 21.34,45.92 25.2,49.78 29.07,49.78 U4.35
BOOT  (via drill 0.35, 0.6)
  Top 0.254: U4.60 32.92,32.36 32.92,31.29 35.76,28.45 v36.78,28.45 | 41.19,18.8 R4.1 | R4.1 41.14,19.1 41.14,20.41 v41.25,20.52 | R4.1 41.14,17.84
  Top 0.305: BOOT.2 41.14,17.84 41.14,19.1
  Bottom 0.254: 37.8,28.45 v36.78,28.45 40.84,28.45 42.67,26.62 42.67,22.96 41.25,21.54 v41.25,20.52
BPHASE  (via drill 0.6)
  Top 0.254: IO1.12 12.56,45.28 v13.61,46.33 | U4.50 29.56,36.08 29.45,35.97 29.04,35.56 21.13,35.56 20.32,34.75 v19.91,34.75
  Bottom 0.254: v13.61,46.33 13.61,40.03 18.69,34.95 19.71,34.95 v19.91,34.75
GND  (via drill 0.35, 0.6)
  Top 0.254: 9.36,39.37 9.36,39.25 v9.31,39.21 | v9.31,44.08 v9.31,42.86 IO1.PAD 8.91,41.24 | IO1.21 4.95,40.02 4.84,39.92 4.84,37.38 4.59,37.12 3.6,37.12 C4.1 | v39.22,49.58 39.22,45.72 38.29,44.79 U4.31 37.59,44.11 37.59,43.69 38.2,43.08 38.68,43.08 U4.28 | v39.42,40.64 39.62,40.64 40.03,40.23 40.03,37.43 U4.12 42.67,34.79 42.67,34.14 41.66,33.12 41.66,31.7 42.06,31.29 43.28,31.29 43.78,30.79 C21.2 44.81,29.97 45.31,29.46 45.31,24.38 44.91,23.98 42.11,23.98 C22.2 | 35.76,34.14 35.76,33.09 U4.63 | LSM6DS0.P$4 32.83,22.56 | 32.83,22.56 32.83,22.15 | 32.83,22.15 32.83,21.95 | 32.83,21.95 LSM6DS0.P$10 | LSM6DS0.P$15 33.93,22.56 | 33.93,22.56 32.83,22.56 | 32.83,22.15 32.73,22.06 LSM6DS0.P$8 31.18,22.06 31.09,22.15 | LSM6DS0.P$9 32.33,21.45 32.83,21.95 | LSM6DS0.P$11 33.33,21.45 32.83,21.95 | LSM6DS0.P$12 33.83,21.74 | 33.83,21.74 33.83,22.45 33.93,22.56 | LSM6DS0.P$13 34.31,21.26 33.83,21.74 | U4.47 31.77,38.61 | IR_S_LEFT.A 48.36,75.44 48.36,77.42
  Top 0.305: 9.11,41.04 8.91,41.24 | 9.31,40.02 9.31,39.82 10.41,38.72 | 9.31,40.02 v9.31,40.43 9.31,40.51 9.48,40.67 | 9.21,43.58 9.31,43.47 v9.31,42.86 | 9.31,40.02 | 8.71,40.02 IO1.21 | U$11.P$6 28.17,42.21 U4.47 | U1.6 10.97,2.85 11.19,2.63 U1.4 U1.3 U1.2 12.79,2.63 13.01,2.85 U1.12 v15.85,2.85
  Top 0.406: 9.31,39.82 9.11,40.02 8.71,40.02 9.36,39.37 IO1.3 | IO1.2 10.61,38.72 9.31,40.02 | IO1.5 9.48,40.67 9.11,41.04 | IO1.15 8.87,43.92 9.21,43.58 | IO1.8 9.48,42.62 9.31,42.46 | v8.13,54.86 8.13,55.55 X1.5 | USER.1 3.66,31.95 | 3.66,31.95 USER.2 | 3.66,31.95 4.27,31.34 4.27,26.01 3.06,24.8 RESET.1 RESET.2 11.04,24.8 C25.1 | 3.66,31.95 3.66,31.9 v4.67,30.89 | LED11.C 2.49,12 LED12.C 2.66,11.98 v3.86,10.77 | 39.62,66.25 40.03,66.66 40.03,68.48 41.25,69.7 43.89,69.7 44.23,69.36 Q2.2 44.23,68.07 | 44.23,68.07 R3.1 | 31.77,38.61 v33.33,38.61 33.33,38.2 33.73,37.8 | 33.73,37.8 35.76,35.76 35.76,34.14 | v29.06,30.07 29.46,29.67 29.46,24.99 v28.65,24.18 29.2,23.64 C27.1 29.3,22.15 31.09,22.15 31.5,21.74 31.5,20.32 32.11,19.71 C14.1 33.93,19.54 33.93,18.29 34.14,18.09 36.58,18.09 37.19,18.69 37.36,18.69 | v33.73,35.76 33.73,37.8 | 37.8,18.45 37.67,18.57 | 37.67,18.57 C26.1 | 44.23,68.07 44.5,68.34 44.5,71.32 45.92,72.75 45.92,76.81 46.53,77.42 48.36,77.42 78.03,77.42 79.65,79.05 83.52,79.05 v85.14,77.42 | LED9.A 83.92,45.06 83.92,48.77 84.33,49.17 85.75,49.17 v85.95,49.38 | 36.78,18.11 37.36,18.69 | 37.36,18.69 37.52,18.85 37.8,18.85 | R4.2 37.8,18.85 | 37.8,18.85 37.8,15.65 40.23,13.21 43.28,13.21 48.59,7.9 IR_S_RIGHT.A | v37.19,16.66 37.19,18.09 37.67,18.57
  Top 0.61: 40.84,62.03 40.84,52.83 39.22,51.21 v39.22,49.58
  Top 0.813: UART.4 40.84,62.03 41.05,62.23 41.05,64.41 39.21,66.25 C8.- 39.62,66.25
  Top 1.016: JP1.1 5.48,70.91 5.89,71.32 25.4,71.32 v26.62,70.1 | 9.16,39.05 9.16,37.41 7.52,35.76 6.2,35.76 C2.2
  Top 1.27: 9.31,47.94 v9.31,44.08 | 9.31,42.46 v9.31,42.86 9.31,47.64 v10.23,48.55 9.52,49.27 C7.- | 9.16,39.05 v9.31,39.21
  Bottom 0.254: v16.87,9.35 v15.85,9.35 | v6.71,9.35 v7.72,9.35
  Bottom 0.305: C18.1 C17.1 13.58,0.61 15.44,0.61 15.85,1.02 v15.85,2.85 15.85,4.32 LASER1.3 | R30.1 Q3.2
  Bottom 0.406: C20.1 6.21,60.85 6.1,60.96 | C16.2 8.44,54.97 v8.13,54.86 6.91,54.66 6.1,53.85 6.1,52.31 | v4.67,30.89 4.67,35.79 | 4.67,35.79 v9.31,40.43 | v3.86,10.77 3.05,10.77 1.42,12.4 1.42,32.53 4.67,35.79 | C1.2 6.72,49.79 7.67,50.74 | U$11.P$6 26.64,41.88 25.6,40.84 16.87,40.84 16.66,40.64 16.66,39.64 U$12.P$6 | v33.33,38.61 33.77,39.05 C6.2 38.59,39.05 C15.2 38.83,40.23 | v39.22,49.58 39.22,47.58 C5.2 | 39.22,46.53 39.22,47.48 C5.2 | v39.42,40.64 39.24,40.64 38.83,40.23 | U$3.P$2 88.81,5.9 89.61,6.71 89.61,16.46 | 89.61,16.46 89.61,26.21 | 89.61,26.21 89.61,36.17 | 89.61,36.17 89.61,46.33 | 89.61,46.33 89.61,46.53 | 89.61,46.53 89.61,56.08 | 89.61,56.08 89.61,65.84 89.21,66.24 88.8,66.24 | 88.8,66.24 88.05,66.24 U$9.P$2 | U$8.P$2 89.54,56.01 89.61,56.08 | U$7.P$2 89.44,46.16 89.61,46.33 | U$6.P$2 89.58,36.2 89.61,36.17 | U$5.P$2 89.23,25.84 89.61,26.21 | U$4.P$2 89.44,16.29 89.61,16.46 | 88.8,66.24 89.41,66.85 89.41,74.37 88.18,75.6 U$10.P$2 87.99,75.91 v87.99,77.62 87.99,78.03 86.56,79.45 85.55,79.45 84.94,78.84 84.94,77.62 v85.14,77.42 | 38.83,40.23 38.83,47.2 C5.2 | v29.06,30.07 29.06,31.09 v33.73,35.76 | v28.65,24.18 27.46,25.37 IC1.7 IC1.2 | IC1.2 IC1.1 19.1,24.03 19.1,22.96 19.91,22.15 C13.1 21.3,21.74 18.09,21.74 16.46,23.37 16.46,24.79 15.04,26.21 TP2.TP | IC1.2 IC1.3 IC1.4 | LASER.3 80.42,39.57 81.69,40.84 81.69,42.82 LED9.A | v85.95,49.38 88.8,46.53 89.61,46.53 | Q3.2 37.19,15.29 v37.19,16.66
  Bottom 0.813: C10.2 20.57,70.76 21.13,71.32 26.82,71.32 40.44,71.32 41.05,70.71 41.05,62.23 UART.4 | 21.49,66.26 C9.2 | C10.2 C9.2 | C11.2 20.62,69.02 C10.2 | C12.2 20.62,67.14 C9.2
  Bottom 1.016: v10.23,48.55 9.52,49.27 9.14,49.27 7.67,50.74 6.1,52.31 6.1,60.96 6.1,65.43 5.48,66.05 JP1.1 | v26.62,70.1 26.62,71.12 26.82,71.32 | 21.49,61.77 IC2.2 21.49,66.26 | 21.49,61.77 27.03,61.77 27.03,51.21 16.05,51.21 16.05,61.77 21.49,61.77
  Bottom 1.27: 9.62,49.16 v10.23,48.55
  other vias: 9.31,41.64 3.73,47.13 11.85,48.55 26.62,68.28 28.45,70.1 28.45,68.28 7.52,69.29 7.52,66.45 10.23,50.18 11.85,50.18 16.66,70.1 16.66,68.48 9.14,69.29 9.14,66.45 16.26,15.65 34.14,52.22 39.62,54.25 6.91,22.96 29.87,62.79 36.78,65.23 86.16,13 84.73,60.35 88.6,49.38 26.82,15.85 85.34,69.7 20.93,33.32 12.4,32.51 21.54,49.58 41.05,64.82 85.95,32.72 36.37,15.44 16.87,27.03 32.11,18.08 14.83,9.35 13.82,9.35 12.8,9.35 11.79,9.35 10.77,9.35 9.75,9.35 8.74,9.35 57.91,74.78 18.49,21.95 21.95,15.85 20.93,12.19 38.61,30.07 42.27,33.93 46.94,12.19 53.04,10.77 45.72,43.28 52.43,71.53 34.14,57.91 7.72,36.37 17.07,31.5 41.05,47.55 70.51,6.3
  pour Top: -11.99,88.6 98.96,88.6 98.96,-5.49 -11.99,-5.49
  pour Bottom: -11.99,99.97 110.13,99.97 110.13,-17.48 -11.99,-17.48
IR_CONTROLL_FRONT  (via drill 0.35)
  Top 0.254: U4.2 37.67,32.72 36.98,32.72 36.58,32.31 36.58,30.07 38.2,28.45 38.2,23.37 38.61,22.96 v39.01,22.96
  Bottom 0.254: v39.01,22.96 40.03,21.95 40.03,19.51 39.01,18.49 37.19,18.49 35.36,16.66 35.36,11.99 35.97,11.38 37.12,11.38 37.39,11.65
  Bottom 0.305: Q3.1 37.39,11.65
  Bottom 0.406: 37.39,11.65 R30.2
IR_LED_FRONT  (via drill 0.35)
  Top 0.305: LED10.K 81.48,37.14 81.48,51.61 82.3,52.43 82.3,75.79 81.48,76.61 56.08,76.61 54.89,75.41 IR_RIGHT.K
  Top 0.406: LED10.K 83.52,35.1 83.52,4.88 82.3,3.66 57.1,3.66 55.07,5.69 55.09,5.72 IR_LEFT.K 53.01,8.3 51,6.3 48.36,6.3 42.67,11.99 v42.47,11.99
  Bottom 0.406: Q3.3 41.74,11.99 v42.47,11.99
LED_1  (via drill 0.6)
  Top 0.254: R28.2 14.12,30.38 19.91,36.17 27.23,36.17 v28.45,37.39 | v35.36,42.27 35.36,42.82 U4.36
  Bottom 0.254: v28.45,37.39 30.48,37.39 v35.36,42.27
LEFT_ENC
  Top 0.254: U$11.P$4 22.64,45.19 25.2,47.75 29.71,47.75 U4.37
LEFT_ENC_B
  Top 0.254: U$11.P$5 24.64,45.97 25.6,46.94 29.8,46.94 U4.38
LINE_LED  (via drill 0.6)
  Top 0.254: v88.8,51.41 89.61,51.41
  Top 0.406: 43.28,70.92 Q2.3 43.28,71.32 45.11,73.15 45.11,77.22 46.13,78.23 77.62,78.23 79.45,80.06 84.33,80.06 v85.95,78.44 | v88.39,12.4 88.8,12.4 89.61,13.21 89.61,21.74 | 89.61,21.74 89.61,32.11 | 89.61,32.11 89.61,41.66 | 89.61,41.66 89.61,51.41 89.61,60.76 | 89.61,60.76 89.61,69.9 89,70.51 v88.39,70.51 | v88.8,60.55 89.41,60.55 89.61,60.76 | v88.6,41.66 89.61,41.66 | v88.6,32.11 89.61,32.11 | v88.8,21.74 89.61,21.74
  Bottom 0.305: LED6.C 88.18,52.02 v88.8,51.41
  Bottom 0.406: v88.8,60.55 88.18,61.17 LED7.C | v88.6,32.11 88.28,31.8 LED3.C | v88.8,21.74 88.28,21.23 LED2.C | v88.39,70.51 88.39,72.66 88.6,72.86 LED8.C 88.06,73.15 86.97,73.15 86.36,73.76 86.36,78.03 v85.95,78.44 | LED5.C 88.08,42.58 v88.6,41.66 88.08,40.74 LED4.C | v88.39,12.4 88.31,12.31 LED1.C
LINE_LED_CONTROLL  (via drill 0.6)
  Top 0.254: v30.89,44.5 30.89,43.73 U4.41 | v41.25,51.41 41.86,52.02 41.86,58.73 42.33,59.2 R3.2
  Top 0.406: R3.2 Q2.1
  Bottom 0.254: v30.89,44.5 31.09,44.3 31.9,44.3 35.76,48.16 35.76,50.19 37.59,52.02 40.64,52.02 v41.25,51.41
M1  (via drill 0.6)
  Top 0.254: IO1.14 5.02,44.57 4.84,44.74 4.84,45.76 5.35,46.27 5.35,47.23 v5.45,47.33 | v25.2,31.9 29.62,31.9 U4.56
  Bottom 0.254: v5.45,47.33 10.78,47.33 11.99,46.13 11.99,40.64 21.34,31.29 24.59,31.29 v25.2,31.9
N$1
  Top 0.406: IO1.6 14.36,41.32 14.83,40.84 14.83,39.22 16.05,38 23.02,38 U$12.P$2
N$2
  Top 0.406: IO1.4 13.83,40.02 14.25,39.6 14.25,38.98 15.84,37.39 25.2,37.39 26.64,38.83 U$12.P$1
N$3
  Top 0.406: IO1.7 16.39,41.97 U$11.P$1
N$4
  Top 0.406: IO1.9 15.43,43.27 16.05,43.89 18.29,43.89 18.69,43.49 18.69,42.27 U$11.P$2
N$5
  Top 0.254: IO1.17 5.19,42.62 4.84,42.97 4.84,43.22 4.34,43.73 3.83,43.73 3.57,43.98 3.57,44.77 C3.2
N$6
  Top 0.254: LSM6DS0.P$14 35.65,22.06 35.97,21.74 35.97,19.88 C14.2
N$7
  Top 0.254: R29.1 84.53,41.66 82.7,39.83 82.7,38.66 LED10.A
N$8
  Top 0.305: IO1.24 IO1.23 IO1.22
N$9
  Top 0.406: R1.2 12.75,37.89 IO1.1
N$13
  Top 0.254: IR_LEFT.A 57.48,11.54 R33.1
N$14  (via drill 0.6)
  Top 0.254: v85.55,11.18 85.55,8.87 R5.1
  Bottom 0.254: LED1.A 84.81,10.44 v85.55,11.18
N$15  (via drill 0.6)
  Top 0.406: R10.1 85.69,19.97 v84.53,21.13
  Bottom 0.406: v84.53,21.13 84.53,19.48 LED2.A
N$16  (via drill 0.6)
  Top 0.254: R12.1 85.49,30.74 v84.73,31.5
  Bottom 0.254: v84.73,31.5 84.73,29.23 LED3.A
N$17  (via drill 0.6)
  Top 0.254: R17.1 85.49,39.07 v84.53,40.03
  Bottom 0.254: 84.94,39.09 LED4.A 84.58,39.98 v84.53,40.03
N$18  (via drill 0.6)
  Top 0.254: R19.1 84.71,43.66 v83.11,42.06
  Bottom 0.254: LED5.A 84.58,43.54 v83.11,42.06
N$19  (via drill 0.6)
  Top 0.254: 85.55,53.05 R21.1 86.36,52.24 v86.36,51.41
  Bottom 0.254: LED6.A 84.68,53.09 85.55,52.22 v86.36,51.41
N$20  (via drill 0.6)
  Top 0.254: v85.95,61.37 85.95,63.01 R23.1
  Bottom 0.254: LED7.A 84.68,62.64 v85.95,61.37
N$21  (via drill 0.6)
  Top 0.254: R25.1 85.08,71.79 v85.75,71.12
  Bottom 0.254: v85.75,71.12 85.75,72.21 LED8.A
N$22
  Top 0.254: IO1.20 4.35,40.67 C4.2
N$23
  Top 0.406: LED12.A 2.47,17.76 R27.2
N$24
  Top 0.406: R31.1 55.88,69.9 57.28,71.3 IR_RIGHT.A
N$26  (via drill 0.35)
  Top 0.254: v14.63,1.42 14.01,1.42 13.69,1.74 13.59,1.74
  Top 0.305: LASER1.4 15.8,6.06 U1.11 13.81,4.06 v14.63,4.06
  Top 0.406: U1.1 13.69,1.74
  Bottom 0.305: R35.2 7.93,4.47 8.33,4.88 13.82,4.88 13.92,4.78 | 13.92,4.78 v14.63,4.06 v14.63,1.42 | 13.92,4.78 13.92,4.61 C17.2 C18.2
N$27
  Top 0.305: U1.9 11.99,4.47 11.79,4.67 9.75,4.67 8.18,6.25 LASER1.1
N$28
  Top 0.305: U1.10 12.79,4.69 12.19,5.28 11.18,5.28 10.77,5.69 10.77,6.86 LASER1.2
N$29  (via drill 0.35)
  Top 0.305: U1.5 10.37,1.83 v8.74,1.83
  Bottom 0.305: v8.74,1.83 8.6,1.69 R35.1
N$33  (via drill 0.6)
  Top 0.254: v6.91,15.85 5.69,15.85 LED11.A | v11.18,26.82 11.97,27.62 R28.1
  Bottom 0.254: v11.18,26.82 7.11,26.82 5.08,24.79 5.08,17.68 v6.91,15.85
N$55  (via drill 0.6)
  Top 0.254: R7.1 10.98,59.68 12.15,60.85 12.15,62.34 v12.4,62.59
  Top 0.406: X1.2 10.43,58.28 R7.1
  Bottom 0.254: v12.4,62.59 12.4,61.09 C20.2
N$56  (via drill 0.6)
  Top 0.254: v13.82,54.66 11.38,54.66 10.97,55.07 10.97,56.86 R8.1
  Top 0.406: X1.3 10.36,57.48 R8.1
  Bottom 0.254: C16.1 13.51,54.97 v13.82,54.66
N$57  (via drill 0.6)
  Top 0.406: X1.1 7.8,59.21 8.94,60.35 9.75,60.35 10.97,61.57 v10.97,63.6
  Bottom 0.406: v10.97,63.6 8.23,63.6 D1.A
OSCIN
  Top 0.254: U4.5 40.23,32.27 40.23,29.67 41.45,28.45 41.45,26.62 40.41,25.58 Q1.3 40.35,24.86 C22.1
OSCOUT
  Top 0.254: U4.6 41.05,32.17 41.05,30.48 41.56,29.97 C21.1 42.08,28.23 42.47,27.84 43.89,27.84 Q1.1
RESET  (via drill 0.6)
  Top 0.254: C25.2 26.56,23.43 v27.64,22.35 | U4.7 38.61,35.29 38.47,35.29 v37.8,35.97
  Top 0.406: RESET.3 RESET.4 9.37,20.95 10.16,21.74 11.27,21.74 R15.1 11.39,23.42 C25.2
  Bottom 0.254: v27.64,22.35 30.68,22.35 32.11,23.77 33.33,23.77 37.39,23.77 38,24.38 38,26.62 37.39,27.23 35.97,27.23 35.76,27.43 35.76,30.48 38.41,33.12 38.41,34.95 37.8,35.56 v37.8,35.97
RIGHT_ENC  (via drill 0.6)
  Top 0.254: U4.53 28.92,33.33 v24.99,33.33
  Bottom 0.254: U$12.P$4 20.64,37.68 v24.99,33.33
RIGHT_ENC_B  (via drill 0.6)
  Top 0.254: v23.17,32.92 23.17,33.53 23.77,34.14 29.02,34.14 U4.52
  Bottom 0.254: U$12.P$5 18.64,37.45 v23.17,32.92
SCL  (via drill 0.35, 0.6)
  Top 0.254: v31.09,29.67 31.09,31.94 U4.58 | LSM6DS0.P$2 33.83,24.9 33.53,25.2 31.5,25.2 v31.09,25.6 | LASER.2 78.28,42.11 77.42,41.25 77.42,35.97 78.03,35.36 80.87,35.36 81.89,34.34 81.89,5.89 81.48,5.49 59.13,5.49 v57.51,7.11 | v36.17,26.21 36.17,25.44 R14.1 | v53.65,7.11 52.02,5.49 48.16,5.49 42.88,10.77 19.71,10.77 18.69,11.79 18.69,18.49 v18.9,18.69
  Bottom 0.254: 31.09,26.82 v31.09,25.6 30.05,26.64 IC1.6 25.66,26.62 22.56,26.62 20.32,28.85 16.05,28.85 15.24,28.04 TP3.TP 13.01,26.82 13.01,20.32 13.82,19.51 18.09,19.51 v18.9,18.69 | 31.09,26.82 v31.09,29.67 | v36.17,26.21 31.7,26.21 31.09,26.82 | 57.1,7.11 v57.51,7.11 v53.65,7.11
SDA  (via drill 0.35, 0.6)
  Top 0.254: 32.76,28.04 R13.1 31.97,26.35 31.7,26.62 30.68,26.62 30.28,26.21 30.28,24.79 30.48,24.59 33.12,24.59 33.33,24.38 LSM6DS0.P$3 | 32.76,28.04 32.76,29.42 32.31,29.87 32.31,32.47 U4.59 | v32.11,28.25 32.56,28.25 32.76,28.04 | v46.61,5.97 42.42,10.16 18.49,10.16 17.88,10.77 17.88,17.88 v17.27,18.49
  Bottom 0.254: LASER.1 77.78,44.65 77.42,44.3 77.42,35.97 78.03,35.36 81.08,35.36 81.89,34.54 81.89,5.89 81.48,5.49 47.09,5.49 v46.61,5.97 | v32.11,28.25 32.92,29.06 32.92,30.28 32.51,30.68 30.48,30.68 30.07,30.28 30.07,28.25 29.74,27.91 IC1.5 23.09,27.91 21.34,29.67 14.63,29.67 14.43,29.87 14.33,29.97 TP4.TP 13.61,30.07 12.4,28.85 12.4,26.62 11.99,26.21 11.99,19.71 13.21,18.49 v17.27,18.49
UART_RX  (via drill 0.6)
  Top 0.254: UART.2 35.71,51.77 v32.72,48.77 | v27.84,46.13 27.84,45.38 U4.43
  Bottom 0.254: v32.72,48.77 31.7,48.77 28.65,45.72 28.25,45.72 v27.84,46.13
UART_TX  (via drill 0.6)
  Top 0.254: UART.3 38.25,60.6 36.58,58.93 36.58,51.61 34.95,49.99 34.95,49.17 v33.73,47.96 | v29.67,45.31 29.67,44.23 U4.42
  Bottom 0.254: v33.73,47.96 33.33,47.55 31.9,47.55 v29.67,45.31
USBDM  (via drill 0.6)
  Top 0.254: R7.2 13.1,58.83 15.44,56.49 15.44,51.61 18.9,48.16 v20.12,48.16 | v26.62,45.72 26.78,45.72 U4.44
  Bottom 0.254: v20.12,48.16 24.18,48.16 v26.62,45.72
USBDP  (via drill 0.6)
  Top 0.254: R8.2 13.81,56.9 14.83,55.88 14.83,53.85 | 14.83,53.85 14.02,53.04 12.32,53.04 R9.2 | 14.83,53.85 14.83,51.21 v19.1,46.94 | v26.21,44.3 27.48,44.3 U4.45
  Bottom 0.254: v19.1,46.94 23.57,46.94 v26.21,44.3
USER_KEY_1  (via drill 0.6)
  Top 0.254: USER.3 2.26,27.45 v3.25,28.45 | v15.85,33.73 16.26,33.73 19.3,36.78 26.01,36.78 v27.84,38.61 | v36.78,43.28 36.78,43.52 U4.33
  Bottom 0.254: v3.25,28.45 7.11,28.45 7.93,29.26 11.38,29.26 v15.85,33.73 | v27.84,38.61 30.48,38.61 35.56,43.69 36.37,43.69 v36.78,43.28
VCC  (via drill 0.6)
  Top 0.254: C7.+ 2.44,49.27 2,49.27 1.9,49.16
  Top 0.305: 3.32,41.97 C3.1
  Top 0.406: IO1.18 3.58,41.97 C3.1 4.23,41.32 IO1.19 | R1.1 9.13,34.53 7.93,33.33 3.25,33.33 2.85,33.73 2.85,35.18 C2.1 2.41,35.19 2.05,34.84 | v1.22,50.8 1.22,50.48 2.44,49.27
  Top 0.61: 1.9,49.16 1.9,48.66
  Top 1.016: C7.+ 3.05,49.79 4.27,51 4.27,54.25 3.25,55.27 3.25,59.74 4.47,60.96 4.47,64.01 3.05,65.43 3.05,67.71 JP1.2
  Top 1.27: 3.2,42.05 C3.1 3.09,42.2 1.8,42.2 1.54,42.46 | 1.54,42.46 1.54,48.3 1.9,48.66 | 2.05,34.84 1.54,35.35 1.54,42.46
  Bottom 0.406: C1.1 2.33,49.69 v1.22,50.8
  Bottom 0.813: IC2.1 18.95,67.1 C9.1 C10.1
  Bottom 1.016: D1.C 2.95,63.7 1.83,64.82 1.83,66.7 2.41,67.29 | 2.41,67.29 JP1.2 | IC2.1 18.95,70.86 18.49,71.32 3.86,71.32 2.24,69.7 2.24,67.46 2.41,67.29

### Text on the board
tNames: UART